# EasyEDA schematic Tiny Radio Reference Build V2 RC5_2020-08-31_21-03-29.json

## Sheets
1 Sheet_1: TITLE: Tiny Radio VFO and Switching; REV: 1.0; Date: 2019-04-01; Sheet: 1/1; Drawn By: EL TAYCHERT; Company: AA2MZ
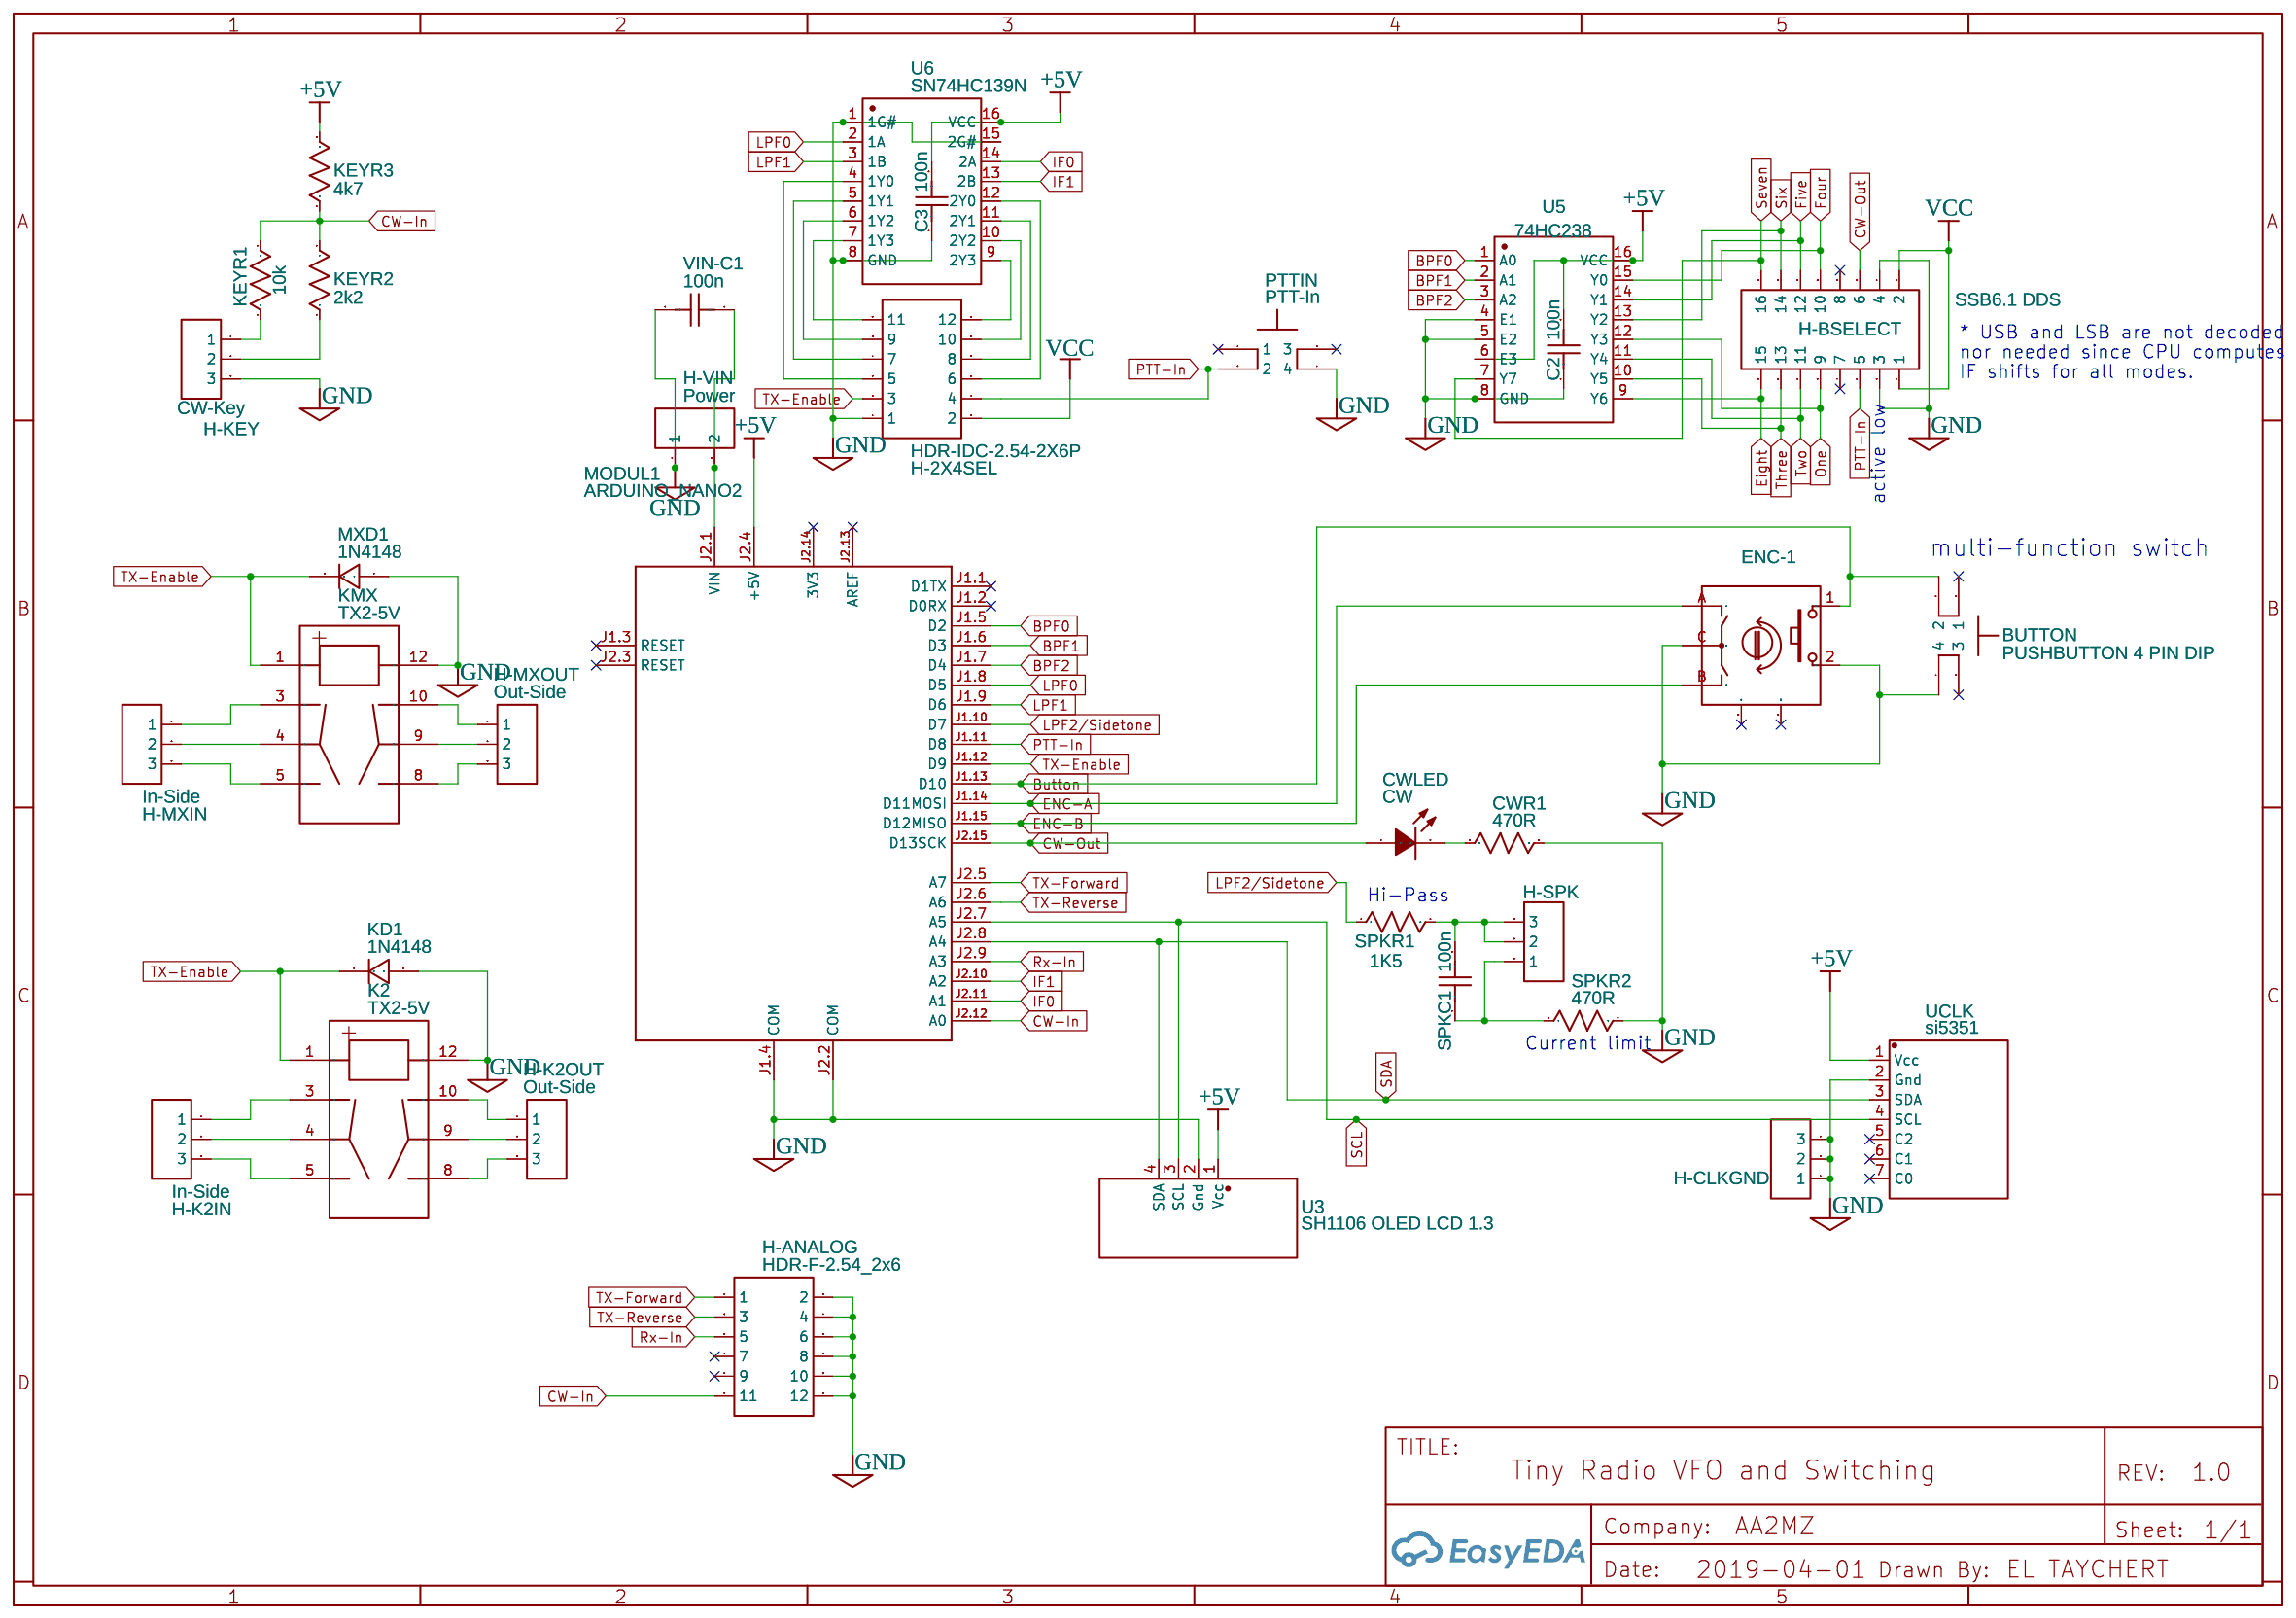
[diagram p0: Sheet_1]
2 Sheet_2: TITLE: Tiny Radio Audio, Vox, AGC & S-Meter; Date: 2020-08-29; Drawn By: EL Taychert
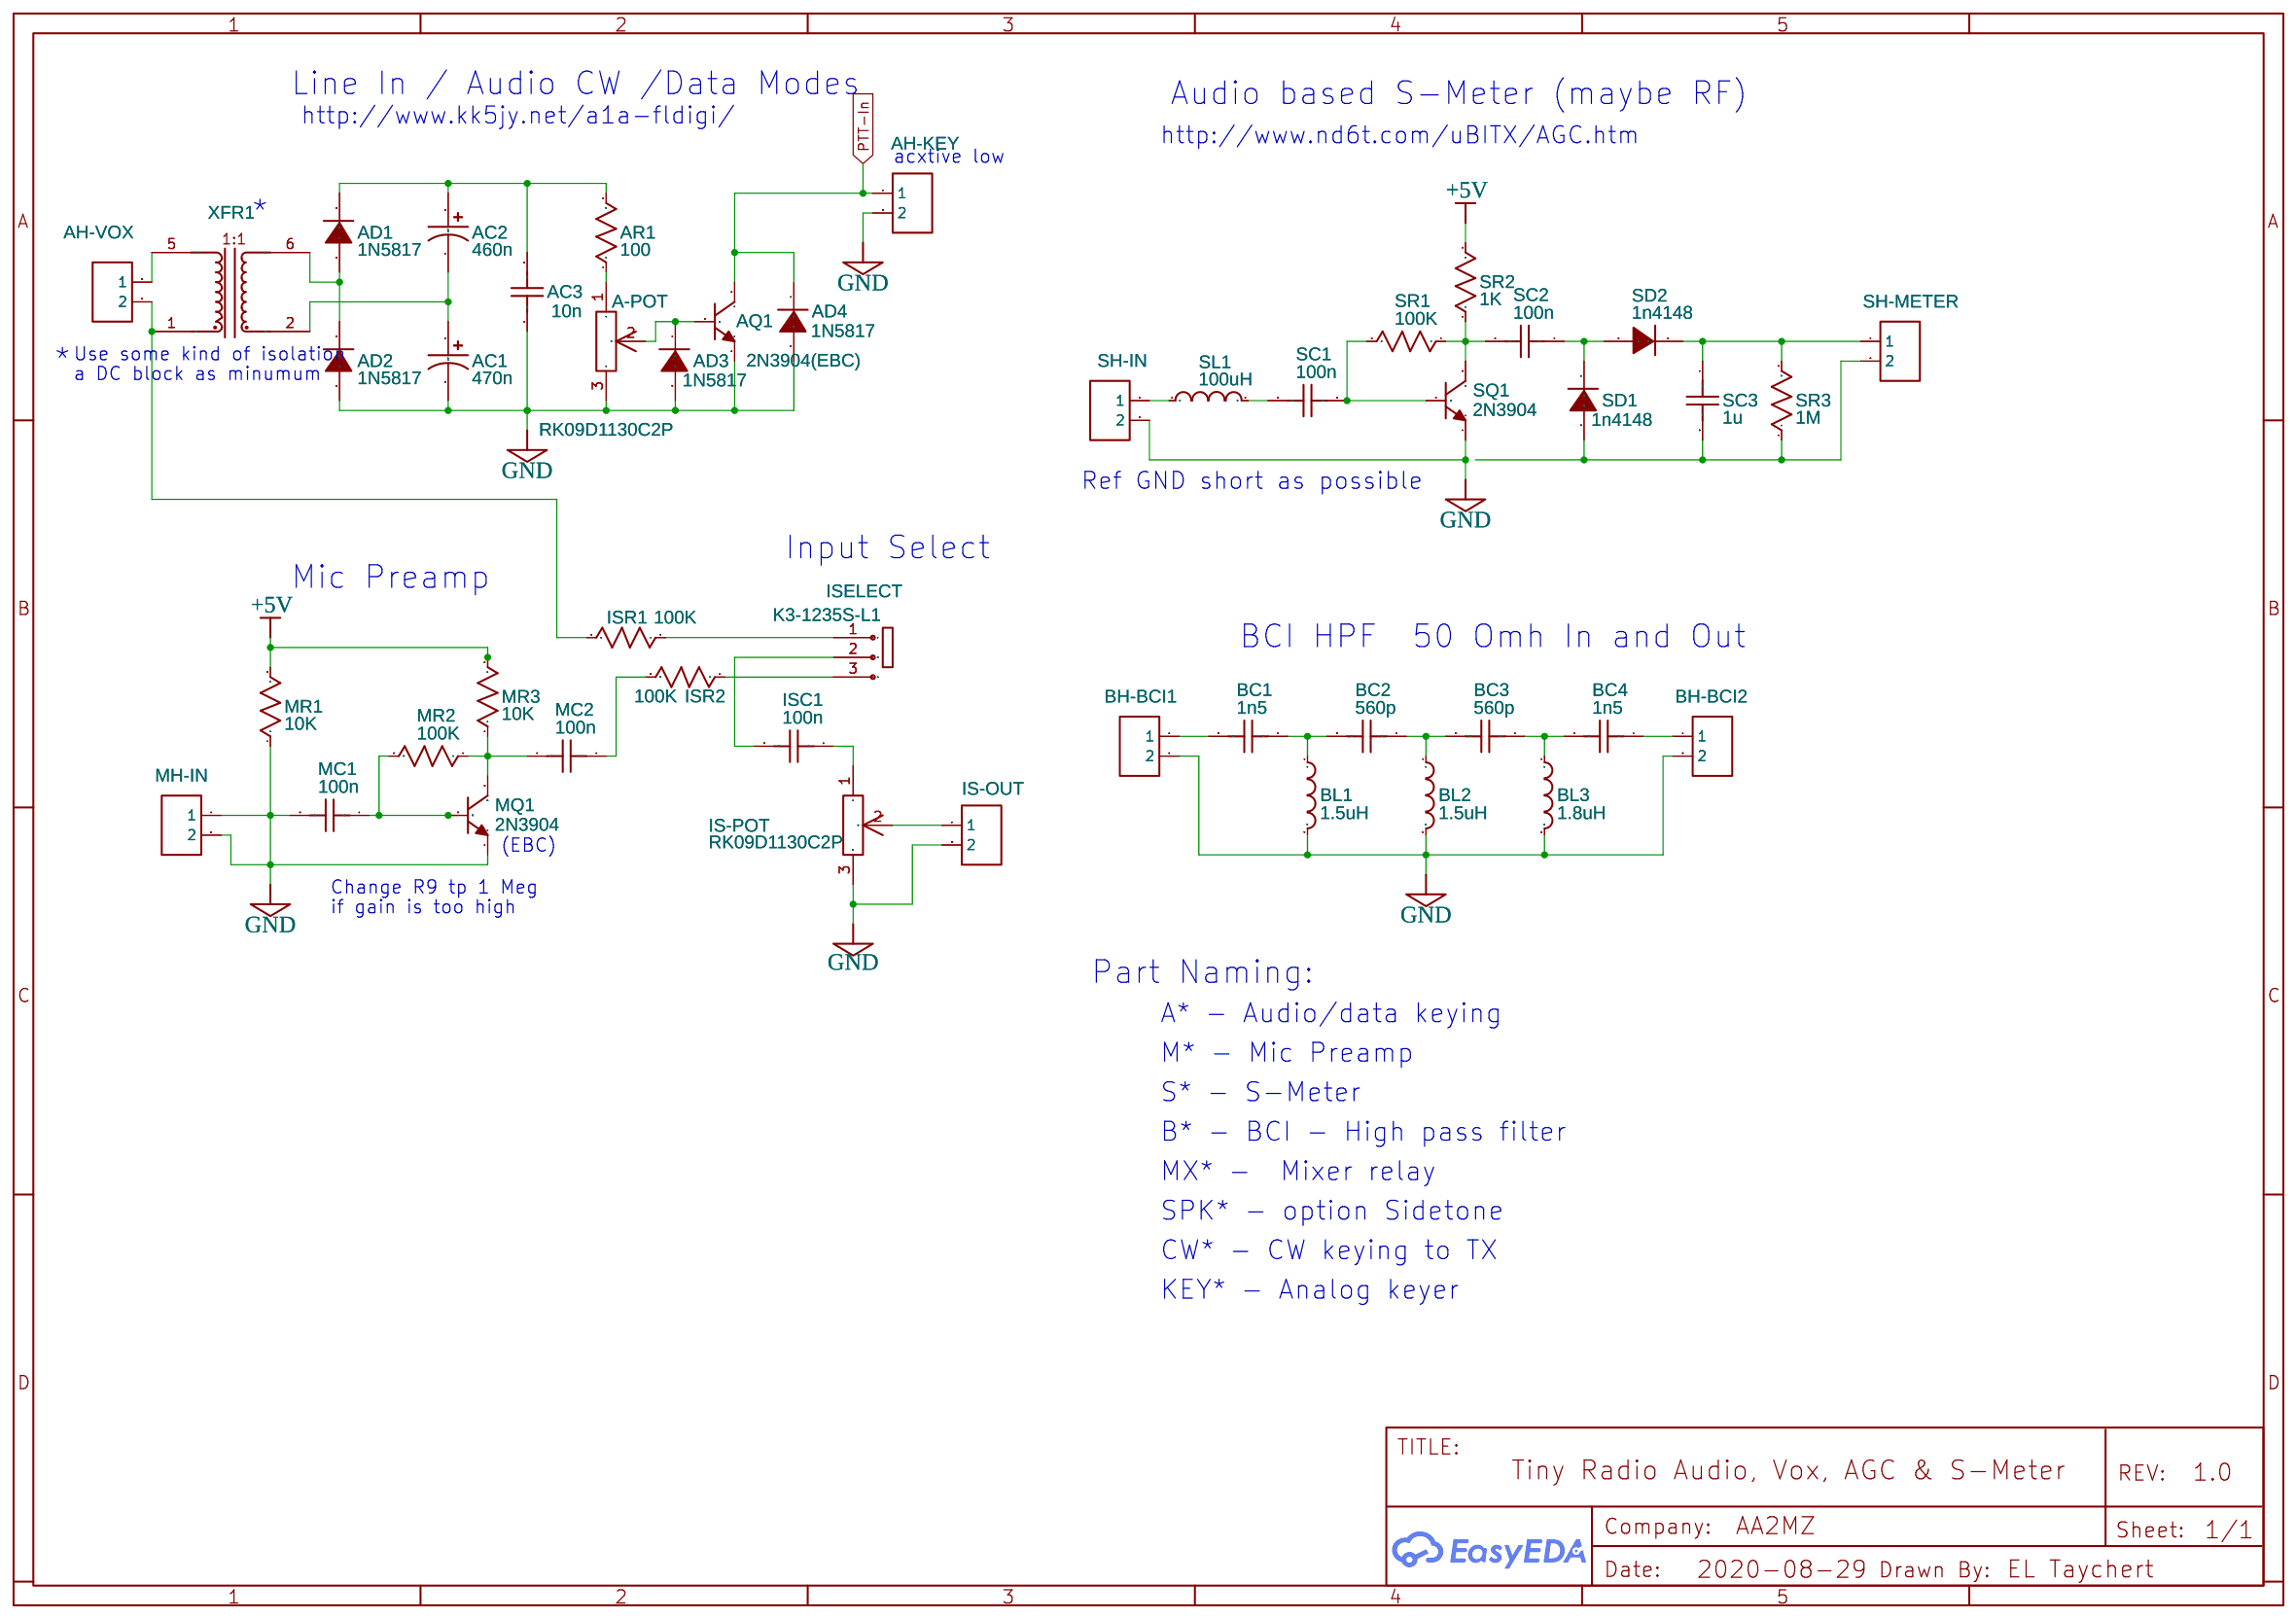
[diagram p1: Sheet_2]

## Parts
sheet Sheet_1
BUTTON  PUSHBUTTON 4 PIN DIP  [PUSH BUTTON 4 PIN DIP]
C2  100n  [RAD-0.2]
C3  100n  [RAD-0.2]
CWLED  CW  [LED-3MM/2.54]
CWR1  470R  [AXIAL-0.3]
ENC-1  PEC11R-4015F-S0024  [BOURNS_PEC11R-4XXXF-SXXXX]
H-2X4SEL  HDR-IDC-2.54-2X6P  [IDC-TH_12P-P2.54_BOOMELE-2X6P-2.54MM]
H-ANALOG  HDR-F-2.54_2x6  [HDR-F-2.54_2X6]
H-BSELECT  SSB6.1 DDS  [IDC-TH_16P-P2.54_C3406]
H-CLKGND  Header-Male-2.54_1x3  [HDR-TH_3P-P2.54-V]
H-K2IN  In-Side  [HDR-TH_3P-P2.54-V]
H-K2OUT  Out-Side  [HDR-TH_3P-P2.54-V]
H-KEY  CW-Key  [HDR-M-2.54_1X3]
H-MXIN  In-Side  [HDR-TH_3P-P2.54-V]
H-MXOUT  Out-Side  [HDR-TH_3P-P2.54-V]
H-SPK  Header-Male-2.54_1x3  [HDR-TH_3P-P2.54-V]
H-VIN  Power  [HDR-2X1/2.54]
K2  TX2-5V  [TX2-5V]
KD1  1N4148  [DO-35_BD2.0-L4.0-P8.00-D0.5-FD]
KEYR1  10k  [AXIAL-0.3]
KEYR2  2k2  [AXIAL-0.3]
KEYR3  4k7  [AXIAL-0.3]
KMX  TX2-5V  [TX2-5V]
MODUL1  ARDUINO_NANO2  [ARDUINO_NANO2]
MXD1  1N4148  [DO-35_BD2.0-L4.0-P8.00-D0.5-FD]
PTTIN  PTT-In  [PUSH BUTTON 4 PIN DIP]
SPKC1  100n  [RAD-0.2]
SPKR1  1K5  [AXIAL-0.3]
SPKR2  470R  [AXIAL-0.3]
U3  SH1106 OLED LCD 1.3  [SH1106_OLED_LCD]
U5  74HC238  [DIP-16]
U6  SN74HC139N  [DIP-16_L19.7-W6.6-P2.54-LS10.9-BL]
UCLK  si5351  [SI5351]
VIN-C1  100n  [RAD-0.2]
sheet Sheet_2
A-POT  RK09D1130C2P  [RK09D1130C2P]
AC1  470n  [CAP-D5.0×F2.0]
AC2  460n  [CAP-D5.0×F2.0]
AC3  10n  [C0805]
AD1  1N5817  [DO-41_BD2.4-L4.7-P8.70-D0.9-RD]
AD2  1N5817  [DO-41_BD2.4-L4.7-P8.70-D0.9-RD]
AD3  1N5817  [DO-41_BD2.4-L4.7-P8.70-D0.9-RD]
AD4  1N5817  [DO-41_BD2.4-L4.7-P8.70-D0.9-RD]
AH-KEY  HDR-M-2.54_1x2  [HDR-M-2.54_1X2]
AH-VOX  HDR-M-2.54_1x2  [HDR-M-2.54_1X2]
AQ1  2N3904(EBC)  [TO-92-3_L5.1-W4.1-P1.27-L]
AR1  100  [R0805]
BC1  1n5  [C0805]
BC2  560p  [C0805]
BC3  560p  [C0805]
BC4  1n5  [C0805]
BH-BCI1  HDR-M-2.54_1x2  [HDR-M-2.54_1X2]
BH-BCI2  HDR-M-2.54_1x2  [HDR-M-2.54_1X2]
BL1  1.5uH  [L_AXIAL-0.5]
BL2  1.5uH  [L_AXIAL-0.5]
BL3  1.8uH  [L_AXIAL-0.5]
IS-OUT  HDR-M-2.54_1x2  [HDR-M-2.54_1X2]
IS-POT  RK09D1130C2P  [RK09D1130C2P]
ISC1  100n  [C0805]
ISELECT  K3-1235S-L1  [SW-TH_K3-1235S-L1]
ISR1  100K  [R_AXIAL-0.3]
ISR2  100K  [R_AXIAL-0.3]
MC1  100n  [C0805]
MC2  100n  [C0805]
MH-IN  HDR-M-2.54_1x2  [HDR-M-2.54_1X2]
MQ1  2N3904  [TO-92-3_L5.1-W4.1-P1.27-L]
MR1  10K  [R0805]
MR2  100K  [R0805]
MR3  10K  [R0805]
SC1  100n  [C0805]
SC2  100n  [C0805]
SC3  1u  [C0805]
SD1  1n4148  [DO-41_BD2.4-L4.7-P8.70-D0.9-RD]
SD2  1n4148  [DO-41_BD2.4-L4.7-P8.70-D0.9-RD]
SH-IN  HDR-M-2.54_1x2  [HDR-M-2.54_1X2]
SH-METER  HDR-M-2.54_1x2  [HDR-M-2.54_1X2]
SL1  100uH  [L_AXIAL-0.5]
SQ1  2N3904  [TO-92-3_L5.1-W4.1-P1.27-L]
SR1  100K  [R0805]
SR2  1K  [R0805]
SR3  1M  [R0603]
XFR1  HR610660  [PWRM-TH_HR610660]

## Library data of the parts
BUTTON PTTIN = -: Manufacturer Part: Pushbutton; Contributor: elnino; Supplier: LAMINGTON
C2 C3 SPKC1 = C_RAD-0.2_US: Contributor: LCEDA_Lib
CWLED = -: Supplier: LCSC; Manufacturer: EVERLIGHT; Manufacturer Part: 204-10SURD/S530-A3; Supplier Part: C99772
CWR1 KEYR1-KEYR3 SPKR1 SPKR2 = Res_AXIAL-0.3(1/8W)_US
ENC-1 = -: Supplier: LCSC; Supplier Part: C143789; Manufacturer: BOURNS; Contributor: LCSC
H-2X4SEL = HDR-IDC-2.54-2X6P: Supplier: LCSC; Manufacturer: BOOMELE; Manufacturer Part: IDC Box 2X6 2.54MM; Supplier Part: C9136
H-ANALOG = HDR-F-2.54_2x6: Supplier Part: C36191; Supplier: LCSC; Contributor: LCEDA_Lib
H-BSELECT = HDR-IDC-2.54-2X8P: Supplier: LCSC; Manufacturer: BOOMELE; Manufacturer Part: IDC Box 2.54mm 16P　Straight; image: //image.lceda.cn/szlcsc/C3406.jpg; Supplier Part: C3406
H-CLKGND H-K2IN H-K2OUT H-MXIN H-MXOUT H-SPK = -: Supplier: LCSC; Manufacturer: BOOMELE; Manufacturer Part: Header2.54mm 1*3P; image: //image.lceda.cn/szlcsc/C49257.jpg; Supplier Part: C49257
H-KEY = HDR-M-2.54_1x3: Supplier Part: C180248; Supplier: LCSC; Contributor: LCEDA_Lib
H-VIN = -: Supplier: LCSC; Manufacturer: TE Connectivity; Manufacturer Part: 826629-2; image: //image.lceda.cn/szlcsc/C86471.jpg; Supplier Part: C86471
K2 KMX = TX2-5V: Supplier: LCSC; Supplier Part: C192257; Manufacturer: PANASONIC; Contributor: LCSC
KD1 MXD1 = 1N4148: Supplier: LCSC; Manufacturer: SEMTECH; Supplier Part: C14516; Contributor: LCEDA_Lib
MODUL1 = ARDUINO_NANO2
U3 = -: Manufacturer Part: OLED_LCD_SH1106; Contributor: mehmetgok
U5 = -: Supplier: Чип и Дип; Manufacturer: Texas Instruments; Manufacturer Part: CD74HC238E; Contributor: LCSC; Supplier Part: 820490127; Чип и Дип: https://www.chipdip.ru/product/74hc238e?from=suggest_product
U6 = SN74HC139N: Supplier: LCSC; Manufacturer: TI; image: //image.lceda.cn/szlcsc/C2906.jpg; Supplier Part: C2906
UCLK = -: Manufacturer Part: ?
VIN-C1 = Cap_RAD-0.2_US
A-POT IS-POT = RK09D1130C2P: Manufacturer: ALPS Electric; Supplier: LCSC; Supplier Part: C361173; link: https://lcsc.com/product-detail/Others_ALPS-Electric-RK09D1130C2P_C361173.html; Contributor: Sanube
AC1 AC2 = CE_TH_D5.0×F2.0_US: Contributor: LCEDA_Lib
AC3 BC1-BC4 ISC1 MC1 MC2 SC1-SC3 = C_0603_US: Contributor: LCEDA_Lib
AD1-AD4 = 1N5817_C256526: Supplier: LCSC; Supplier Part: C256526; Manufacturer: GD; Contributor: LCSC
AH-KEY AH-VOX BH-BCI1 BH-BCI2 IS-OUT MH-IN SH-IN SH-METER = HDR-M-2.54_1x2: Supplier Part: C124375; Supplier: LCSC; Contributor: LCEDA_Lib
AQ1 = 2N3904(TO-92): Supplier: LCSC; Manufacturer: SEMTECH; Manufacturer Part: 2N3904; Supplier Part: C118538; Contributor: LCEDA_Lib
AR1 ISR1 ISR2 MR1-MR3 SR1-SR3 = R_0603_US: Contributor: LCEDA_Lib
BL1-BL3 SL1 = L_AXIAL-0.5_US: Contributor: LCEDA_Lib
ISELECT = K3-1235S-L1: Supplier: LCSC; Supplier Part: C223838; Manufacturer: Korean Hroparts Elec; Contributor: LCSC
MQ1 SQ1 = 2N3904(TO-92): Supplier: LCSC; Manufacturer: SEMTECH; Supplier Part: C118538; Contributor: LCEDA_Lib
SD1 SD2 = 1N5817_C256526: Supplier: LCSC; Supplier Part: C256526; Manufacturer: GD; Manufacturer Part: 1N5817; Contributor: LCSC
XFR1 = HR610660: Supplier: LCSC; Manufacturer: HANRUN; image: //image.lceda.cn/szlcsc/C48357.jpg; Supplier Part: C48357

## Nets
+5V: C2.2 C3.2 KEYR3.2 MODUL1.J2.4(+5V) MR1.2 MR3.2 SR2.2 U3.1(Vcc) U5.6(E3) U5.16(VCC) U6.16(VCC) UCLK.1(Vcc)
GND: A-POT.3 AC1.2 AC3.1 AD2.2(A) AD3.2(A) AD4.2(A) AH-KEY.2 AQ1.1(E) BH-BCI1.2 BH-BCI2.2 BL1.2 BL2.2 BL3.2 BUTTON.4 C2.1 C3.1 CWR1.2 ENC-1.2 ENC-1.C H-2X4SEL.1 H-ANALOG.2 H-ANALOG.4 H-ANALOG.6 H-ANALOG.8 H-ANALOG.10 H-ANALOG.12 H-BSELECT.3 H-BSELECT.4 H-CLKGND.1 H-CLKGND.2 H-CLKGND.3 H-KEY.3 H-VIN.1 IS-OUT.2 IS-POT.3 K2.12 KD1.1 KMX.12 MC1.2 MH-IN.1 MH-IN.2 MODUL1.J1.4(COM) MODUL1.J2.2(COM) MQ1.1(E) MR1.1 MXD1.1 PTTIN.4 SH-IN.2 SPKR2.2 SQ1.1(E) U3.2(Gnd) U5.4(E1) U5.5(E2) U5.8(GND) U6.1(1G#) U6.8(GND) U6.15(2G#) UCLK.2(Gnd) VIN-C1.2
VCC: H-2X4SEL.2 H-BSELECT.1 H-BSELECT.2
BPF0: MODUL1.J1.5(D2) U5.1(A0)
BPF1: MODUL1.J1.6(D3) U5.2(A1)
BPF2: MODUL1.J1.7(D4) U5.3(A2)
Button: BUTTON.2 ENC-1.1 MODUL1.J1.13(D10)
CW-In: H-ANALOG.11 KEYR1.2 KEYR2.2 KEYR3.1 MODUL1.J2.12(A0)
CW-Out: CWLED.1(A) H-BSELECT.6 MODUL1.J2.15(D13SCK)
Eight: H-BSELECT.15 U5.9(Y6)
ENC-A: ENC-1.A MODUL1.J1.14(D11MOSI)
ENC-B: ENC-1.B MODUL1.J1.15(D12MISO)
Five: H-BSELECT.12 U5.14(Y1)
Four: H-BSELECT.10 U5.15(Y0)
IF0: MODUL1.J2.11(A1) U6.14(2A)
IF1: MODUL1.J2.10(A2) U6.13(2B)
LPF0: MODUL1.J1.8(D5) U6.2(1A)
LPF1: MODUL1.J1.9(D6) U6.3(1B)
LPF2/Sidetone: MODUL1.J1.10(D7) SPKR1.1
One: H-BSELECT.9 U5.12(Y3)
PTT-In: AD4.1(K) AH-KEY.1 AQ1.3(C) H-2X4SEL.4 H-BSELECT.5 MODUL1.J1.11(D8) PTTIN.2
Rx-In: H-ANALOG.5 MODUL1.J2.9(A3)
SCL: MODUL1.J2.7(A5) U3.3(SCL) UCLK.4(SCL)
SDA: MODUL1.J2.8(A4) U3.4(SDA) UCLK.3(SDA)
Seven: H-BSELECT.16 U5.7(Y7)
Six: H-BSELECT.14 U5.13(Y2)
Three: H-BSELECT.13 U5.10(Y5)
Two: H-BSELECT.11 U5.11(Y4)
TX-Enable: H-2X4SEL.3 K2.1 KD1.2 KMX.1 MODUL1.J1.12(D9) MXD1.2
TX-Forward: H-ANALOG.1 MODUL1.J2.5(A7)
TX-Reverse: H-ANALOG.3 MODUL1.J2.6(A6)
Net-(A-POT-1): A-POT.1 AR1.1
Net-(A-POT-2): A-POT.2 AD3.1(K) AQ1.2(B)
Net-(AC1-1): AC1.1 AC2.2 XFR1.2
Net-(AC2-1): AC2.1 AC3.2 AD1.1(K) AR1.2
Net-(AD1-2): AD1.2(A) AD2.1(K) XFR1.6
Net-(AH-VOX-1): AH-VOX.1 XFR1.5
Net-(AH-VOX-2): AH-VOX.2 ISR1.2 XFR1.1
Net-(BC1-1): BC1.1 BC2.2 BL1.1
Net-(BC1-2): BC1.2 BH-BCI1.1
Net-(BC2-1): BC2.1 BC3.2 BL2.1
Net-(BC3-1): BC3.1 BC4.2 BL3.1
Net-(BC4-1): BC4.1 BH-BCI2.1
Net-(CWLED-2): CWLED.2(K) CWR1.1
Net-(H-2X4SEL-5): H-2X4SEL.5 U6.4(1Y0)
Net-(H-2X4SEL-6): H-2X4SEL.6 U6.12(2Y0)
Net-(H-2X4SEL-7): H-2X4SEL.7 U6.5(1Y1)
Net-(H-2X4SEL-8): H-2X4SEL.8 U6.11(2Y1)
Net-(H-2X4SEL-9): H-2X4SEL.9 U6.6(1Y2)
Net-(H-2X4SEL-10): H-2X4SEL.10 U6.10(2Y2)
Net-(H-2X4SEL-11): H-2X4SEL.11 U6.7(1Y3)
Net-(H-2X4SEL-12): H-2X4SEL.12 U6.9(2Y3)
Net-(H-K2IN-1): H-K2IN.1 K2.3
Net-(H-K2IN-2): H-K2IN.2 K2.4
Net-(H-K2IN-3): H-K2IN.3 K2.5
Net-(H-K2OUT-1): H-K2OUT.1 K2.10
Net-(H-K2OUT-2): H-K2OUT.2 K2.9
Net-(H-K2OUT-3): H-K2OUT.3 K2.8
Net-(H-KEY-1): H-KEY.1 KEYR1.1
Net-(H-KEY-2): H-KEY.2 KEYR2.1
Net-(H-MXIN-1): H-MXIN.1 KMX.3
Net-(H-MXIN-2): H-MXIN.2 KMX.4
Net-(H-MXIN-3): H-MXIN.3 KMX.5
Net-(H-MXOUT-1): H-MXOUT.1 KMX.10
Net-(H-MXOUT-2): H-MXOUT.2 KMX.9
Net-(H-MXOUT-3): H-MXOUT.3 KMX.8
Net-(H-SPK-1): H-SPK.1 SPKC1.1 SPKR2.1
Net-(H-SPK-2): H-SPK.2 H-SPK.3 SPKC1.2 SPKR1.2
Net-(H-VIN-2): H-VIN.2 MODUL1.J2.1(VIN) VIN-C1.1
Net-(IS-OUT-1): IS-OUT.1 IS-POT.2
Net-(IS-POT-1): IS-POT.1 ISC1.1
Net-(ISC1-2): ISC1.2 ISELECT.2
Net-(ISELECT-1): ISELECT.1 ISR1.1
Net-(ISELECT-3): ISELECT.3 ISR2.1
Net-(ISR2-2): ISR2.2 MC2.1
Net-(MC1-1): MC1.1 MQ1.2(B) MR2.2
Net-(MC2-2): MC2.2 MQ1.3(C) MR2.1 MR3.1
Net-(SC1-1): SC1.1 SQ1.2(B) SR1.2
Net-(SC1-2): SC1.2 SL1.2
Net-(SC2-1): SC2.1 SD1.1(K) SD2.2(A)
Net-(SC2-2): SC2.2 SQ1.3(C) SR1.1 SR2.1
Net-(SC3-1): SC3.1 SD2.1(K) SH-METER.1 SR3.2
Net-(SC3-2): SC3.2 SD1.2(A) SH-METER.2 SR3.1
Net-(SH-IN-1): SH-IN.1 SL1.1

Not connected (* = marked no-connect by the designer): BUTTON 1* 3*; ENC-1 MT1* MT2*; H-ANALOG 7* 9*; H-BSELECT 7* 8*; MODUL1 J1.1(D1TX)* J1.2(D0RX)* J1.3(RESET)* J2.3(RESET)* J2.13(AREF)* J2.14(3V3)*; PTTIN 1* 3*; UCLK 5(C2)* 6(C1)* 7(C0)*

## Notes on the sheets
sheet 1
- * USB and LSB are not decoded
- nor needed since CPU computes
- IF shifts for all modes.
- active low
- multi-function switch
- Hi-Pass
- Current limit
sheet 2
- Line In / Audio CW /Data Modes
- Audio based S-Meter (maybe RF)
- http://www.kk5jy.net/a1a-fldigi/
- http://www.nd6t.com/uBITX/AGC.htm
- acxtive low
- *
- *
- Use some kind of isolation
- a DC block as minumum
- Ref GND short as possible
- Input Select
- Mic Preamp
- BCI HPF  50 Omh In and Out
- (EBC)
- Change R9 tp 1 Meg
- if gain is too high
- Part Naming:
- A* - Audio/data keying
- M* - Mic Preamp
- S* - S-Meter
- B* - BCI - High pass filter
- MX* -  Mixer relay
- SPK* - option Sidetone
- CW* - CW keying to TX
- KEY* - Analog keyer
